# EAGLE design Side 1 v1.1 (EAGLE 8.5.0)
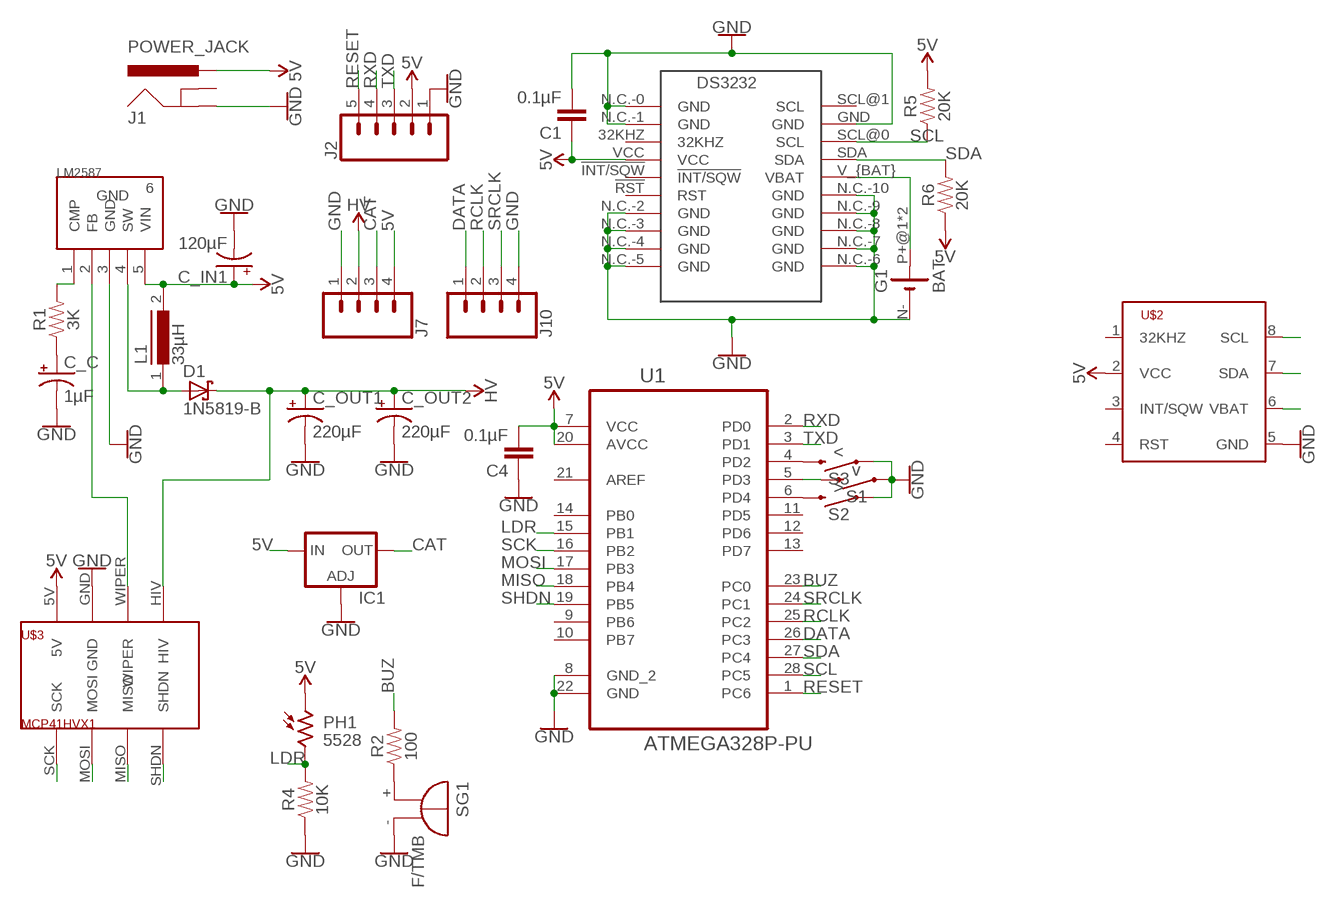
[diagram p0: schematic, sheet 1]

## Parts
C1  0.1µF  0.1µF-0.1''  [CAP-0.1I]
C4  0.1µF  0.1µF-0.1''  [CAP-0.1I]
C_C  1µF  CAP_POL_1µF  [CAP_POL_2MM]
C_IN1  120µF  CAP_POL_120µF  [CAP_POL_3MM]
C_OUT1  220µF  1000UF-RADIAL-5MM-25V-20%  [CPOL-RADIAL-5MM-10MM]
C_OUT2  220µF  1000UF-RADIAL-5MM-25V-20%  [CPOL-RADIAL-5MM-10MM]
D1  1N5819-B  [DO41-7.6]
G1  BAT  BATTERY-HOLDER_11.6MM  [CELL_RETAINER_11.6MM]
IC1  LM317TS  [317TS]
J1  POWER_JACK  [POWER_JACK_PTH]
J2  CONN_05  [1X05]
J7  CONN_04  [1X04]
J10  CONN_04  [1X04]
L1  33µH  MICC12  [MICC12]
LM2587  LM2587S  [TO263-5]
PH1  5528  [5528]
R1  3K  RESISTORAXIAL-0.3  [AXIAL-0.3]
R2  100  RESISTORAXIAL-0.3  [AXIAL-0.3]
R4  10K  RESISTORAXIAL-0.3  [AXIAL-0.3]
R5  20K  RESISTORAXIAL-0.3  [AXIAL-0.3]
R6  20K  RESISTORAXIAL-0.3  [AXIAL-0.3]
S1  v  MOMENTARY-SWITCH-SPST-PTH-6.0MM  [TACTILE_SWITCH_PTH_6.0MM]
S2  >  MOMENTARY-SWITCH-SPST-PTH-6.0MM  [TACTILE_SWITCH_PTH_6.0MM]
S3  <  MOMENTARY-SWITCH-SPST-PTH-6.0MM  [TACTILE_SWITCH_PTH_6.0MM]
SG1  F/TMB  [F/TMB]
U1  ATMEGA328P-PU  [DIP254P762X457-28]
U$1  DS3232  [SO20-2]
U$2  DS3232M  [SO8]
U$3  MCP41HVX1  MCP41HVX1_BREAKOUT  [MCP41HVX1_BREAKOUT]

## Nets
5V: C1.1 C4.2 C_IN1.POS(+) IC1.3(IN) J1.PWR J2.2 J7.4 L1.2 LM2587.5(VIN) PH1.1 R5.P$2 R6.P$1 U1.7(VCC) U1.20(AVCC) U$1.VCC U$2.2(VCC) U$3.5V
BAT: G1.P+@1(+) G1.P+@2(+) U$1.V_{BAT}(VBAT) U$2.6(VBAT)
BUZ: R2.P$2 U1.23(PC0)
BUZR: R2.P$1 SG1.+
CAT: IC1.2(OUT) J7.3
DATA: J10.1 U1.26(PC3)
GND: C1.2 C4.1 C_C.NEG(-) C_IN1.NEG(-) C_OUT1.- C_OUT2.- G1.N-(-) IC1.1(ADJ) J1.GND J2.1 J7.1 J10.4 LM2587.3(GND) R4.P$1 S1.1 S2.1 S3.1 SG1.- U1.8(GND_2) U1.22(GND) U$1.GND U$1.N.C.-0(GND) U$1.N.C.-1(GND) U$1.N.C.-2(GND) U$1.N.C.-3(GND) U$1.N.C.-4(GND) U$1.N.C.-5(GND) U$1.N.C.-6(GND) U$1.N.C.-7(GND) U$1.N.C.-8(GND) U$1.N.C.-9(GND) U$1.N.C.-10(GND) U$2.5(GND) U$3.GND
LBUT: S3.3 U1.4(PD2)
LDR: PH1.2 R4.P$2 U1.15(PB1)
MBUT: S1.3 U1.5(PD3)
MISO: U1.18(PB4) U$3.MISO
MOSI: U1.17(PB3) U$3.MOSI
N$1: D1.A L1.1 LM2587.4(SW)
N$2: LM2587.1(CMP) R1.P$2
N$4: C_C.POS(+) R1.P$1
N$8: LM2587.2(FB) U$3.WIPER
RBUT: S2.3 U1.6(PD4)
RCLK: J10.2 U1.25(PC2)
RESET: J2.5 U1.1(PC6)
RXD: J2.4 U1.2(PD0)
SCK: U1.16(PB2) U$3.SCK
SCL: R5.P$1 U1.28(PC5) U$1.SCL@0(SCL) U$2.8(SCL)
SDA: R6.P$2 U1.27(PC4) U$1.SDA U$2.7(SDA)
SHDN: U1.19(PB5) U$3.SHDN
SRCLK: J10.3 U1.24(PC1)
TXD: J2.3 U1.3(PD1)
VCC: C_OUT1.+ C_OUT2.+ D1.C J7.2 U$3.HIV ; supply symbol labelled HV
Unconnected: J1.GNDBREAK LM2587.6(GND) U1.9(PB6) U1.10(PB7) U1.11(PD5) U1.12(PD6) U1.13(PD7) U1.14(PB0) U1.21(AREF) U$1.32KHZ U$1.!INT/SQW U$1.!RST(RST) U$1.SCL@1(SCL) U$2.1(32KHZ) U$2.3(INT/SQW) U$2.4(RST)

## Library data of the parts
C1 C4 = Clock components:0.1µF: 0.1uF/100nF/100,000pF ceramic capacitors A capacitor is a passive two-terminal electrical component used to store electrical energy temporarily in an electric field.
C_C = Clock components:CAP_POL_1µF
C_IN1 = Clock components:CAP_POL_120µF
C_OUT1 C_OUT2 = SparkFun-Capacitors:1000UF: 1,000µF/1mF ceramic capacitors A capacitor is a passive two-terminal electrical component used to store electrical energy temporarily in an electric field. CAP-08070; PROD_ID: CAP-09538; VALUE: 1mF
D1 = diode:1N581*: 1.0A SCHOTTKY BARRIER RECTIFIER Source: http://www.diodes.com/datasheets/ds23001.pdf
G1 = battery:BATTERY-HOLDER_11.6MM: 11.6mm PC BUTTON CELL RETAINER, high 5.97mm KEYSTONE ELECTRONICS CORP. Data sheet <http://www.farnell.com/cad/1718310.pdf>; MF: KEYSTONE; MPN: 2997; OC_FARNELL: 2293265
IC1 = v-reg:LM317TS: VOLTAGE REGULATOR
J1 = SparkFun-Connectors:POWER_JACK: Power Jack Connector This is the standard 5.5mm barrel jack for power. The PTH is the most common, proven, reliable, footprint. The Slot footprint only works if the mill layer is transmitted to the PCB fab house so be warned. Here are the connectors we sell at SparkFun: DC Barrel Power Jack/Connector <https://www.sparkfun.com/products/119> (PRT-00119) DC Barrel Power Jack/Connector (SMD) <https://www.sparkfun.com/products/12748> (PRT-12748) DC Barrel Jack Adapter - Breadboard Compatible <https://www.sparkfun.com/products/10811> (PRT-10811) It is used on this SparkFun product (and many, many others): SparkFun RedBoard - Programmed with Arduino <https://www.sparkfun.com/products/12757> (DEV-12757) Also, if you need a mating power supply or connector, please check these out: Wall Adapter Power Supply - 9VDC 650mA <https://www.sparkfun.com/products/298> (TOL-00298) DC Barrel Jack Adapter - Male <https://www.sparkfun.com/products/10287> (PRT-10287); PROD_ID: CONN-08197
J2 = SparkFun-Connectors:CONN_05: Multi connection point. Often used as Generic Header-pin footprint for 0.1 inch spaced/style header connections On any of the 0.1 inch spaced packages, you can populate with these: Break Away Headers - Straight <https://www.sparkfun.com/products/116> (PRT-00116) Break Away Male Headers - Right Angle <https://www.sparkfun.com/products/553> (PRT-00553) Female Headers <https://www.sparkfun.com/products/115> (PRT-00115) Break Away Headers - Machine Pin <https://www.sparkfun.com/products/117> (PRT-00117) Break Away Female Headers - Swiss Machine Pin <https://www.sparkfun.com/products/743> (PRT-00743) For SCREWTERMINALS and SPRING TERMINALS visit here: Screw Terimnals on SparkFun.com <https://www.sparkfun.com/search/results?term=Screw+Terminals> (5mm/3.5mm/2.54mm spacing) This device is also useful as a general connection point to wire up your design to another part of your project. Our various solder wires solder well into these plated through hole pads. Hook-Up Wire - Assortment (Stranded, 22 AWG) <https://www.sparkfun.com/products/11375> (PRT-11375) Hook-Up Wire - Assortment (Solid Core, 22 AWG) <https://www.sparkfun.com/products/11367> (PRT-11367) View the entire wire category on our website here <https://www.sparkfun.com/categories/141> Special notes: Molex polarized connector foot print use with SKU : PRT-08231 with associated crimp pins and housings. 1MM SMD Version SKU: PRT-10208
J7 J10 = SparkFun-Connectors:CONN_04: Multi connection point. Often used as Generic Header-pin footprint for 0.1 inch spaced/style header connections On any of the 0.1 inch spaced packages, you can populate with these: Break Away Headers - Straight <https://www.sparkfun.com/products/116> (PRT-00116) Break Away Male Headers - Right Angle <https://www.sparkfun.com/products/553> (PRT-00553) Female Headers <https://www.sparkfun.com/products/115> (PRT-00115) Break Away Headers - Machine Pin <https://www.sparkfun.com/products/117> (PRT-00117) Break Away Female Headers - Swiss Machine Pin <https://www.sparkfun.com/products/743> (PRT-00743) For SCREWTERMINALS and SPRING TERMINALS visit here: Screw Terimnals on SparkFun.com <https://www.sparkfun.com/search/results?term=Screw+Terminals> (5mm/3.5mm/2.54mm spacing) This device is also useful as a general connection point to wire up your design to another part of your project. Our various solder wires solder well into these plated through hole pads. Hook-Up Wire - Assortment (Stranded, 22 AWG) <https://www.sparkfun.com/products/11375> (PRT-11375) Hook-Up Wire - Assortment (Solid Core, 22 AWG) <https://www.sparkfun.com/products/11367> (PRT-11367) View the entire wire category on our website here <https://www.sparkfun.com/categories/141> Special notes: Molex polarized connector foot print use with SKU : PRT-08231 with associated crimp pins and housings. 1MM SMD Version SKU: PRT-10208; PROD_ID: CONN-09696
L1 = inductors:MICC12: INDUCTOR; SPICEPREFIX: L
LM2587 = Clock components:LM2587S: LM2587 SIMPLE SWITCHER 5A Flyback Regulator
PH1 = Clock components:5528
R1 R2 R4-R6 = SparkFun-Resistors:RESISTOR: Generic Resistor Package
S1-S3 = SparkFun-Switches:MOMENTARY-SWITCH-SPST: Momentary Switch (Pushbutton) - SPST Normally-open (NO) SPST momentary switches (buttons, pushbuttons). Variants PTH-12MM - 12mm square, through-hole Momentary Pushbutton Switch - 12mm Square <https://www.sparkfun.com/products/9190> (COM-09190) PTH-6.0MM, PTH-6.0MM-KIT - 6.0mm square, through-hole Mini Pushbutton Switch <https://www.sparkfun.com/products/97> (COM-00097) KIT package intended for soldering kit's - only one side of pads' copper is exposed. PTH-RIGHT-ANGLE-KIT - Right-angle, through-hole Right Angle Tactile Button <https://www.sparkfun.com/products/10791> - Used on SparkFun BigTime Watch Kit <https://www.sparkfun.com/products/11734> SMD-12MM - 12mm square, surface-mount Tactile Button - SMD (12mm) <https://www.sparkfun.com/products/12993> (COM-12993) Used on SparkFun PicoBoard <https://www.sparkfun.com/products/11888> SMD-4.5MM - 4.5mm Square Trackball Switch Used on SparkFun Blackberry Trackballer Breakout <https://www.sparkfun.com/products/13169> SMD-4.6MMX2.8MM - 4.60mm x 2.80mm, surface mount Used on SparkFun SAMD21 Mini Breakout <https://www.sparkfun.com/products/13664> SMD-5.2MM, SMD-5.2-REDUNDANT - 5.2mm square, surface-mount Mini Pushbutton Switch - SMD <https://www.sparkfun.com/products/8720> (COM-08720) Used on Arduino Pro Mini <https://www.sparkfun.com/products/11114> REDUNDANT package connects both switch circuits together SMD-6.0X3.5MM - 6.0 x 3.5mm, surface mount Momentary Reset Switch SMD <https://www.sparkfun.com/products/8229> (COM-08229) SMD-6.2MM-TALL - 6.2mm square, surface mount Tactile Button - SMD (6mm) <https://www.sparkfun.com/products/12992> Used on SparkFun Digital Sandbox <https://www.sparkfun.com/products/12651> SMD-RIGHT-ANGLE - Right-angle, surface mount Used on SparkFun Block for Intel® Edison - Arduino <https://www.sparkfun.com/products/13036>; PROD_ID: SWCH-08441; SF_SKU: COM-00097
SG1 = buzzer:F/TMB: BUZZER Source: Buerklin; OC_FARNELL: unknown; OC_NEWARK: unknown
U1 = Atmel_By_element14_Batch_1-00:ATMEGA328P-PU: 8-bit Microcontroller with In-System Programmable Flash; MPN: ATMEGA328P-PU; OC_FARNELL: 1715487; OC_NEWARK: 15R0268; PACKAGE: PDIP-28; SUPPLIER: Atmel
U$1 = ds3232:DS3232: Maxims DS3232 is a high precision rtc
U$2 = Clock components:DS3232M
U$3 = Clock components:MCP41HVX1_BREAKOUT

## Board
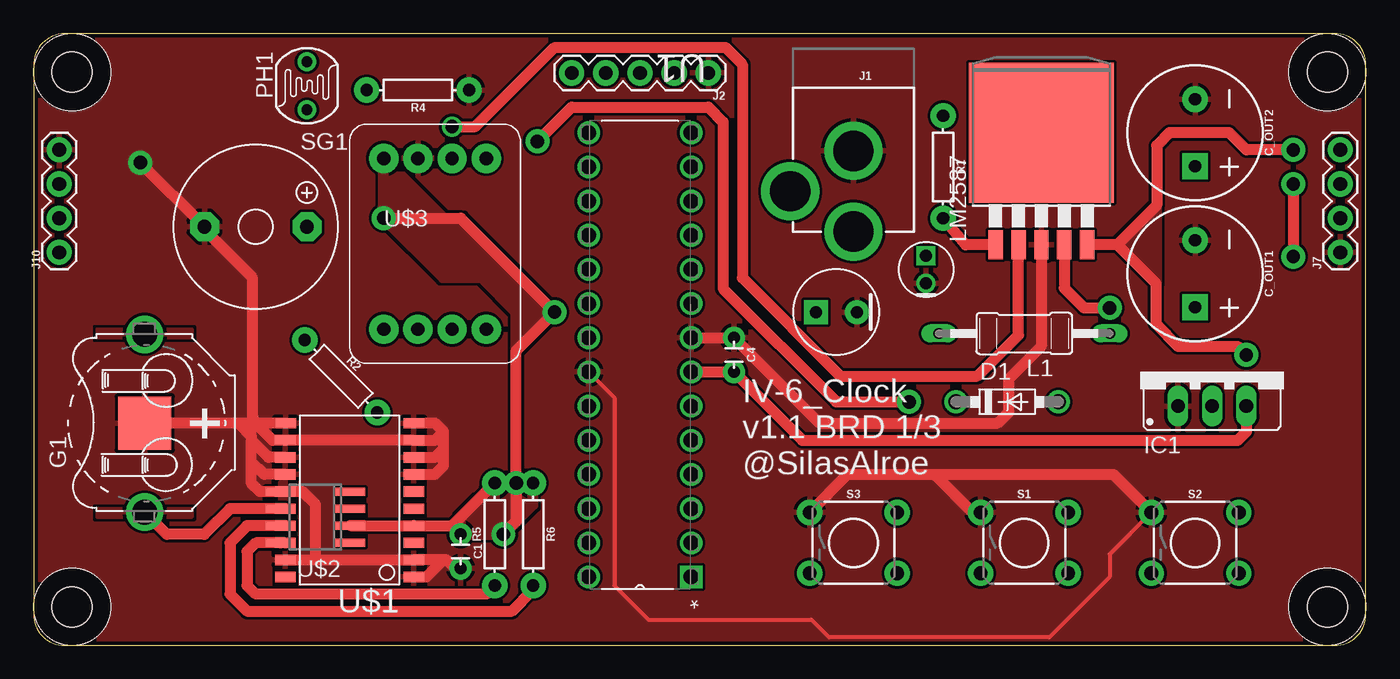
[diagram p1: board, top side]
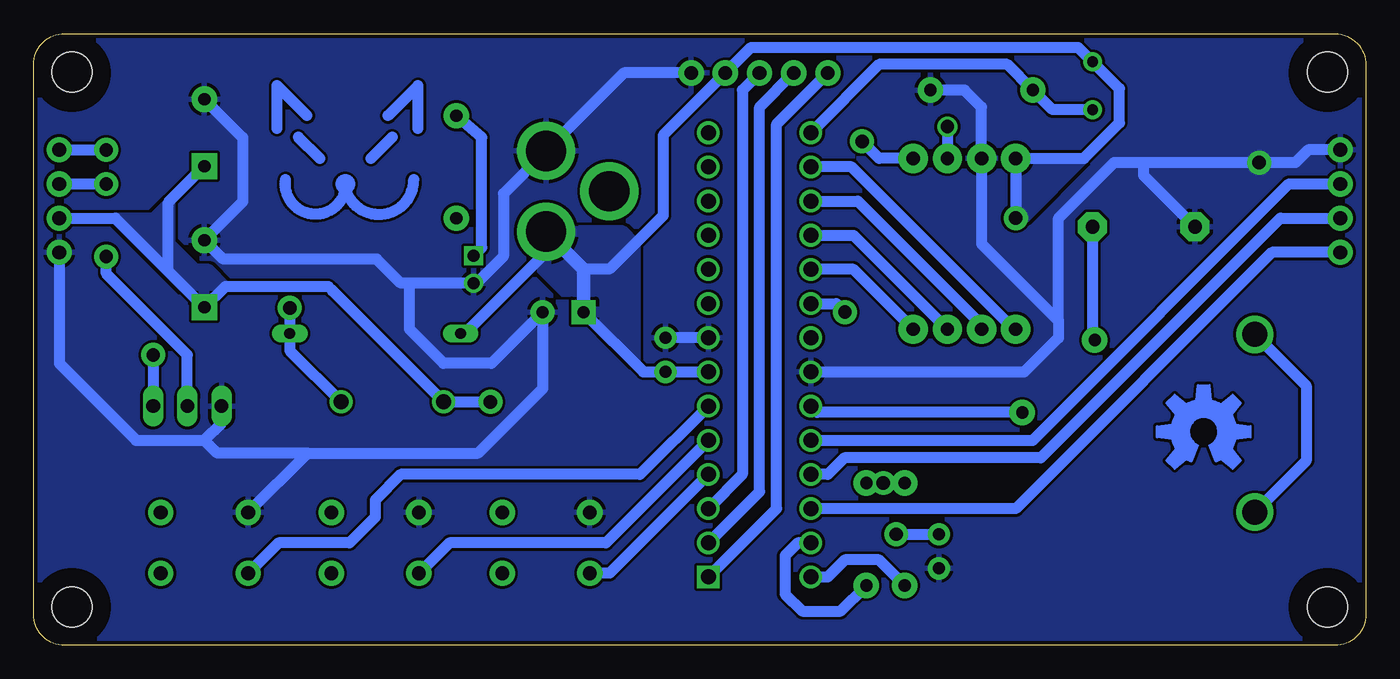
[diagram p2: board, bottom side, seen from below]

Size 99.06 x 45.47 mm. Coordinates in mm from the lower left corner, seen from the top.
Outline: 96.77,45.47 2.28,45.47 arc90 0,43.11 0,2.29 arc90 2.29,0 96.77,0 arc90 99.06,2.29 99.06,43.18 arc90 96.77,45.47
Copper layers (1*16): Top 0.035mm / dielectric 1.5mm / Bottom 0.035mm
Design rules "default *": minimum track width 6mil, minimum drill 0.35mm, track to track 8mil, track to pad 8mil, pad to pad 8mil, via to via 8mil, smd to smd 8mil, copper to edge 12mil, drill to drill 12mil, minimum pad ring 10mil, minimum via ring 8mil, stop-mask expansion 4mil, vias tented up to drill 0mil, thermal gap 10mil
Holes 3 mm at 2.86,2.86 2.86,42.61 96.2,42.61 96.2,2.86
tRestrict: area 1.2,1.2 to 4.5,4.5; area 1.2,40.9 to 4.5,44.2; area 94.6,40.9 to 97.8,44.2; area 94.6,1.2 to 97.8,4.5
bRestrict: area 1.2,1.2 to 4.5,4.5; area 1.2,40.9 to 4.5,44.2; area 94.6,40.9 to 97.8,44.2; area 94.6,1.2 to 97.8,4.5

### Footprints (pad centres in the part's own frame; a part is rotated, then mirrored left to right if it is on the bottom)
CAP-0.1I = drill 0.9 pad 1.651: 1 -1.27,0; 2 1.27,0
CAP_POL_2MM = drill 0.9: NEG 1.016,0 | drill 0.9 square: POS -1.016,0
CAP_POL_3MM = drill 0.9 pad 1.778: NEG 1.524,0 | drill 0.9 pad 1.778 square: POS -1.524,0
CPOL-RADIAL-5MM-10MM = drill 0.9 pad 1.93 square: + 2.5,0 | drill 0.9 pad 1.93: - -2.5,0
DO41-7.6 = drill 1.1 pad 1.7: A 3.81,0; C -3.81,0
CELL_RETAINER_11.6MM = smd 3.96 x 3.96: N- 0,0 | drill 1.85 pad 2.54: P+@1 -6.605,0; P+@2 6.605,0
317TS = drill 1.016 long: 1 -2.54,-2.54; 2 0,-2.54; 3 2.54,-2.54
POWER_JACK_PTH = drill 2.997 pad 4.318: GND 0,7.7; GNDBREAK 4.7,10.7; PWR 0,13.7
1X05 = drill 1.016 pad 1.88: 1 0,0; 2 2.54,0; 3 5.08,0; 4 7.62,0; 5 10.16,0
1X04 = drill 1.016 pad 1.88: 1 0,0; 2 2.54,0; 3 5.08,0; 4 7.62,0
MICC12 = drill 0.813 long: 1 -6.35,0; 2 6.35,0
TO263-5 = smd 1.067 x 2.159: 1 -3.404,-5.791; 2 -1.702,-5.791; 3 0,-5.791; 4 1.702,-5.791; 5 3.404,-5.791 | smd 10.8 x 10.41: 6 0,2.54
5528 = drill 0.8 pad 1.4: 1 -1.778,0; 2 1.778,0
AXIAL-0.3 = drill 0.9 pad 1.88: P$1 -3.81,0; P$2 3.81,0
TACTILE_SWITCH_PTH_6.0MM = drill 1.016 pad 1.88: 1 -3.251,2.261; 2 3.251,2.261; 3 -3.251,-2.261; 4 3.251,-2.261
F/TMB = drill 1.016 pad 2.159 octagon: + 3.81,0; - -3.81,0
DIP254P762X457-28 = drill 1.118 square: 1 -7.62,33.02 | drill 1.118: 2 -7.62,30.48; 3 -7.62,27.94; 4 -7.62,25.4; 5 -7.62,22.86; 6 -7.62,20.32; 7 -7.62,17.78; 8 -7.62,15.24; 9 -7.62,12.7; 10 -7.62,10.16; 11 -7.62,7.62; 12 -7.62,5.08; 13 -7.62,2.54; 14 -7.62,0; 15 0,0; 16 0,2.54; 17 0,5.08; 18 0,7.62; 19 0,10.16; 20 0,12.7; 21 0,15.24; 22 0,17.78; 23 0,20.32; 24 0,22.86; 25 0,25.4; 26 0,27.94; 27 0,30.48; 28 0,33.02
SO20-2 = smd 0.762 x 1.524: 32KHZ -3.175,-4.775; !INT/SQW -0.635,-4.775; !RST 0.635,-4.775; GND 0.635,4.775; N.C.-0 -5.715,-4.775; N.C.-1 -4.445,-4.775; N.C.-2 1.905,-4.775; N.C.-3 3.175,-4.775; N.C.-4 4.445,-4.775; N.C.-5 5.715,-4.775; N.C.-6 5.715,4.75; N.C.-7 4.445,4.775; N.C.-8 3.175,4.775; N.C.-9 1.905,4.775; N.C.-10 -4.445,4.775; SCL@0 -3.175,4.775; SCL@1 -5.715,4.775; SDA -1.905,4.775; V_{BAT} -0.635,4.775; VCC -1.905,-4.775
SO8 = smd 0.6 x 2.2: 1 -1.905,-2.6; 2 -0.635,-2.6; 3 0.635,-2.6; 4 1.905,-2.6; 5 1.905,2.6; 6 0.635,2.6; 7 -0.635,2.6; 8 -1.905,2.6
MCP41HVX1_BREAKOUT = drill 1 pad 2.184: 5V 2.54,15.24; GND 5.08,15.24; HIV 10.16,15.24; MISO 7.62,2.54; MOSI 5.08,2.54; SCK 2.54,2.54; SHDN 10.16,2.54; WIPER 7.62,15.24

### Placement (x,y rotation side)
C1  31.75,6.99 270 top
C4  52.07,21.59 270 top
C_C  66.36,27.94 270 top
C_IN1  59.69,24.77 0 top
C_OUT1  86.36,27.62 270 top
C_OUT2  86.36,38.1 270 top
D1  72.39,18.1 0 top
G1  8.26,16.51 90 top
IC1  87.63,20.32 0 top
J1  60.96,44.45 180 top
J2  50.16,42.55 180 top
J7  97.16,29.21 90 top
J10  1.91,29.21 90 top
L1  73.66,23.18 180 top
LM2587  74.93,35.56 0 top
PH1  20.32,41.59 270 top
R1  67.63,35.56 270 top
R2  22.86,20 315 top
R4  28.57,41.27 180 top
R5  34.29,8.26 90 top
R6  37.15,8.26 270 top
S1  73.66,7.62 0 top
S2  86.36,7.62 0 top
S3  60.96,7.62 0 top
SG1  16.52,31.11 0 top
U1  41.27,38.1 180 top
U$1  23.5,10.79 90 top
U$2  20.95,9.53 90 top
U$3  23.5,20.95 0 top
U$4  [OSHW-LOGO-L_COPPER_BOTTOM]  12.06,15.88 0 top

### Tracks (layer width: path | path; a pad name or v marks a point on that pad's centre or on a via)
5V  (via drill 1 pad 1.78)
  Top 0.813: v93.66,36.83 90.17,36.83 88.9,38.1 84.45,38.1 83.5,37.15 83.5,32.7 80.57,29.77 | 80.57,29.77 LM2587.5 | IC1.3 90.17,15.88 89.53,15.24 57.15,15.24 C4.2 U1.7 | 31.11,8.89 R5.P$2 34.28,12.06 | 31.11,8.89 U$1.VCC U$2.2 24.55,8.89 | C1.1 31.11,8.89 | 80.57,29.77 83.42,26.91 83.42,23.89 85.09,22.23 89.53,22.23 v90.17,21.59 | v26.04,31.75 31.75,31.75 v38.73,24.77 35.88,21.91 v35.88,12.06 35.88,9.21 v34.92,8.26
  Bottom 0.813: C_IN1.POS 53.72,20.32 U1.7 | J1.PWR 60.96,29.21 66.99,23.18 L1.2 | J7.4 v93.66,36.83 | 58.17,27.96 56.24,27.96 52.26,31.94 52.26,37.91 J2.2 45.72,44.45 21.4,44.45 PH1.1 18.32,41.37 18.32,38.83 20.95,36.2 U$3.5V | v38.73,24.77 39.37,25.4 U1.20 | 25.4,36.2 U$3.5V | U$3.5V v26.04,31.75 | v90.17,21.59 IC1.3 | R6.P$1 v35.88,12.06 R5.P$2 | v34.92,8.26 C1.1
  Bottom 1.016: J1.PWR 58.17,27.96 C_IN1.POS
  pour Bottom: 54.29,20.95 54.29,29.84 55.24,30.8 60.96,30.8 61.59,30.16 61.59,28.57 61.59,28.26 58.1,24.77
  pour Top: 83.5,26.99 83.5,32.7 80.64,29.84
  pour Top: 35.88,21.91 35.88,27.62 38.73,24.77
  pour Top: 34.92,8.26 37.15,10.48 37.15,12.06 34.29,12.06 31.43,9.21 31.43,8.57 31.75,8.26
  pour Bottom: 20.95,36.2 25.4,31.75 26.04,31.75 26.04,36.2
  pour Top: 26.04,36.2 30.48,31.75 31.75,31.75 38.73,24.77 35.88,24.77 33.34,27.3 30.48,27.3 26.04,31.75
BAT
  Top 0.813: G1.P+@1 9.9,8.26 12.7,8.26 14.61,10.16 U$1.V_{BAT} U$2.6
  Bottom 0.813: G1.P+@2 4.45,19.3 4.45,13.71 G1.P+@1
  pour Top: 4.76,10.16 11.75,10.16 11.75,9.53 4.76,9.53
  pour Top: 4.76,22.86 4.76,23.5 11.75,23.5 11.75,22.86
BUZ
  Bottom 0.813: R2.P$2 40.8,17.31 U1.23
BUZR
  Bottom 0.813: SG1.+ 20.32,22.86 R2.P$1
CAT  (via drill 1 pad 1.78)
  Top 0.813: v93.66,34.29 v93.66,28.89
  Bottom 0.813: v93.66,28.89 93.66,27.62 87.63,21.59 IC1.2 | J7.3 v93.66,34.29
DATA
  Bottom 0.813: J10.1 6.99,29.21 26.04,10.16 U1.26
GND  (via drill 1 pad 1.78)
  Top 0.305: S2.1 80.01,6.78 80.01,5.08 75.52,0.59 59.15,0.59 57.83,1.91 45.72,1.91 43.18,4.45 43.18,18.41 U1.22
  Top 0.813: LM2587.3 74.93,22.23 72.52,19.81 72.52,17.34 71.69,16.51 58.42,16.51 C4.1 | U$1.N.C.-6 16.51,16.51 | 16.19,16.51 15.24,16.51 | 15.24,16.51 G1.N- | U$1.N.C.-10 20.95,6.35 | 20.95,6.35 U$1.N.C.-1 30.48,6.35 | U$1.N.C.-2 29.84,12.7 30.48,13.34 30.48,14.61 | U$1.GND 20,11.43 20.95,10.48 20.95,6.35 | U$1.GND 17.78,11.43 | 30.48,14.61 30.48,15.88 | 30.48,15.88 29.84,15.24 U$1.N.C.-4 U$1.N.C.-7 17.78,15.24 16.51,16.51 | U$1.N.C.-3 29.84,13.97 30.48,14.61 | U$1.GND 16.83,11.43 16.19,12.06 16.19,13.65 | 16.19,13.65 16.19,15.24 | 16.19,15.56 16.19,16.51 | 16.51,16.51 16.19,16.51 | 16.19,15.24 17.46,13.97 U$1.N.C.-8 | 16.19,13.65 17.14,12.7 U$1.N.C.-9 | 15.24,16.51 16.19,15.56 | 16.19,15.56 16.19,15.24 | 30.48,6.35 30.72,6.35 31.35,5.71 C1.2 | U$1.N.C.-0 29.21,5.08 30.48,6.35 | U1.8 52.05,22.86 52.06,22.85 | S3.1 60.53,12.7 66.99,12.7 | 66.99,12.7 69.81,9.88 S1.1 | 66.99,12.7 80.29,12.7 S2.1 | 30.48,15.88 29.84,16.51 29.21,16.51 | 16.51,16.51 16.28,17.05 16.28,27.3 12.71,30.88 SG1.- v7.94,35.88
  Bottom 0.813: IC1.1 85.09,16.51 86.36,15.24 | 86.36,15.24 91.44,15.24 97.16,20.95 J7.1 | 86.36,30.48 C_OUT1.- | S2.1 78.7,14.29 | 78.7,14.29 66,14.29 61.21,19.07 C_IN1.NEG 65.02,20.95 68.58,20.95 71.12,23.5 71.12,26.92 | 78.7,14.29 85.41,14.29 86.36,15.24 | 71.12,26.92 C_C.NEG 66.12,26.92 64.14,28.91 64.14,33.58 J1.GND 55.16,42.55 J2.1 | 71.12,26.92 71.75,26.92 73.55,28.71 84.95,28.71 C_OUT1.- | C_OUT2.- 83.5,37.74 83.5,32.98 C_OUT1.- | SG1.- 16.51,34.92 16.51,35.88 | U1.22 25.4,20.32 22.86,22.86 22.86,24.13 | 22.86,24.13 22.86,31.75 18.73,35.88 16.51,35.88 | U1.8 C4.1 | 22.86,24.13 28.57,29.84 U$3.GND 28.57,40.01 29.84,41.27 R4.P$1 | J10.4 4.29,36.83 5.25,35.88 v7.94,35.88 16.51,35.88
  pour Bottom (rank 6): 0,0 0,45.4 98.11,45.4 99.06,44.45 99.06,0
  pour Top (rank 6): 0,0 0,44.45 0.95,45.4 99.06,45.4 99.06,0
  pour Bottom (no thermals): 9.53,2.22 11.44,10.16 24.77,10.16 31.11,2.22
  pour Top (no thermals): 59.05,3.81 88.27,3.81 88.27,1.27 59.05,1.27
  pour Top: 5.4,41.27 5.71,42.23 17.14,42.23 17.14,40.96 19.37,38.73 20.64,38.73 25.72,39.05 25.72,36.83 5.4,37.15
  pour Top: 47.62,4.13 47.62,39.69 47.31,40.01 44.45,40.01 44.13,39.69 44.13,4.45 44.45,4.13
LBUT
  Bottom 0.813: U1.4 56.24,5.36 S3.3
LDR
  Bottom 0.813: PH1.2 23.3,39.81 R4.P$2 26.67,43.18 36.2,43.18 U1.15
MBUT
  Bottom 0.813: S1.3 68.15,7.62 56.52,7.62 U1.5
MISO
  Bottom 0.813: U1.18 38.1,30.48 U$3.MISO
MOSI
  Bottom 0.813: U1.17 37.78,33.02 28.57,23.81 U$3.MOSI
N$1  (via drill 1 pad 1.78)
  Top 0.813: LM2587.4 76.63,26.56 78.11,25.08 v80.01,25.08
  Bottom 0.813: v80.01,25.08 L1.1 80.01,21.91 D1.A
N$2
  Top 0.813: LM2587.1 69.29,29.77 R1.P$2
N$3
  Bottom 0.813: 70.8,34.61 arc166 75.88,33.97 arc180 80.33,34.61
N$4
  Bottom 0.813: R1.P$1 65.75,37.76 65.75,29.57 C_C.POS
N$5
  Bottom 0.813: 72.39,37.78 73.98,36.2
N$6
  Bottom 0.813: 77.79,36.2 79.38,37.78
N$7
  Bottom 0.813: 70.48,38.42 70.48,41.59 72.71,39.37
N$8  (via drill 1)
  Top 0.813: LM2587.2 73.23,23.06 70.17,20 60.01,20 52.7,27.3 52.7,43.18 51.44,44.45 38.73,44.45 32.84,38.55 v31.11,38.55
  Bottom 0.813: v31.11,38.55 U$3.WIPER
N$9
  Bottom 0.813: 80.96,38.42 80.96,41.59 78.74,39.37
RBUT
  Bottom 0.813: S2.3 80.85,7.62 75.56,7.62 73.66,9.53 73.66,10.79 71.75,12.7 53.98,12.7 U1.6
RCLK
  Bottom 0.813: J10.2 6.35,31.75 24.17,13.93 38.77,13.93 40.01,12.7 U1.25
RESET
  Bottom 0.813: U1.1 43.81,10.16 43.81,38.73 J2.5
RXD
  Bottom 0.813: U1.2 45.09,11.43 45.09,40.01 J2.4
SCK
  Bottom 0.813: U$3.SCK 26.17,23.5 38.23,35.56 U1.16
SCL
  Top 0.813: R5.P$1 33.66,3.81 16.51,3.81 15.88,4.45 15.88,6.99 16.51,7.62 U$1.SCL@0 U$2.8
  Bottom 0.813: U1.28 40.01,5.08 38.73,6.35 36.2,6.35 R5.P$1
SDA
  Top 0.813: U$2.7 U$1.SDA 15.88,8.89 14.61,7.62 14.61,3.81 15.88,2.54 35.56,2.54 37.15,4.13 R6.P$2
  Bottom 0.813: U1.27 42.23,7.62 43.18,6.67 43.18,3.81 41.91,2.54 39.05,2.54 R6.P$2
SHDN
  Bottom 0.813: U$3.SHDN 38.1,27.94 U1.19
SRCLK
  Bottom 0.813: J10.3 5.71,34.29 24.77,15.24 U1.24
TXD
  Bottom 0.813: J2.3 46.35,41.27 46.35,12.7 U1.3
VCC  (via drill 1 pad 1.78)
  Top 0.813: v37.47,37.47 40.01,40.01 50.16,40.01 51.28,38.89 51.28,26.51 59.69,18.1 v65.09,18.1
  Bottom 0.813: 89.04,27.8 C_OUT1.+ 84.81,26.67 77.15,26.67 76.83,26.35 D1.C v65.09,18.1 | 89.04,27.8 89.04,32.92 C_OUT2.+ | J7.2 92.99,31.75 89.04,27.8 | U$3.HIV 36.2,36.2 v37.47,37.47
  pour Bottom: 88.9,33.02 90.17,31.75 93.03,31.75 88.9,27.62
  pour Bottom: 84.77,26.67 86.04,27.94 86.68,27.94 87,27.94 88.9,29.84 88.9,27.62 86.36,25.08
(copper drawn outside any net)
  shapes: Bottom circle x1

### Text on the board
tNames: IV-6_Clock / v1.1 BRD 1/3 / @SilasAlroe
tRestrict: WARNING / Do not under any | Notice: Not machine washable | < | v | >
bRestrict: IV-6_Clock / v1.1 BRD 1/3 / @SilasAlroe